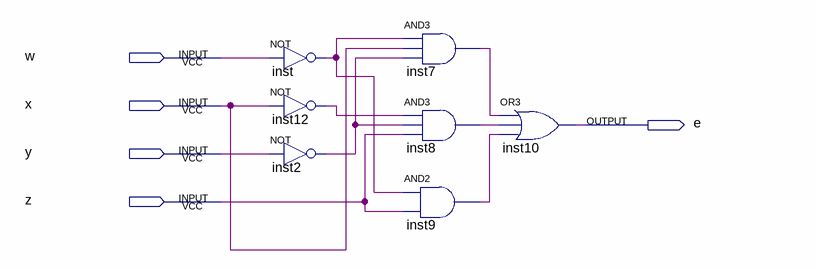
[diagram p0: schematic sheet]
// Quartus schematic E.bdf as structural Verilog: 7 symbols, 5 pins
module E (
  input  w,
  input  x,
  input  y,
  input  z,
  output e
);

  wire inst2_out, inst7_out, inst8_out, inst9_out, inst12_out, inst_out;

  not inst (inst_out, w);
  not inst12 (inst12_out, x);
  not inst2 (inst2_out, y);
  and inst7 (inst7_out, inst_out, x, inst2_out);
  and inst8 (inst8_out, inst12_out, inst2_out, z);
  and inst9 (inst9_out, inst_out, z);
  or inst10 (e, inst7_out, inst8_out, inst9_out);
endmodule
